# EAGLE schematic Impedance_Potential (EAGLE 9.6.2)
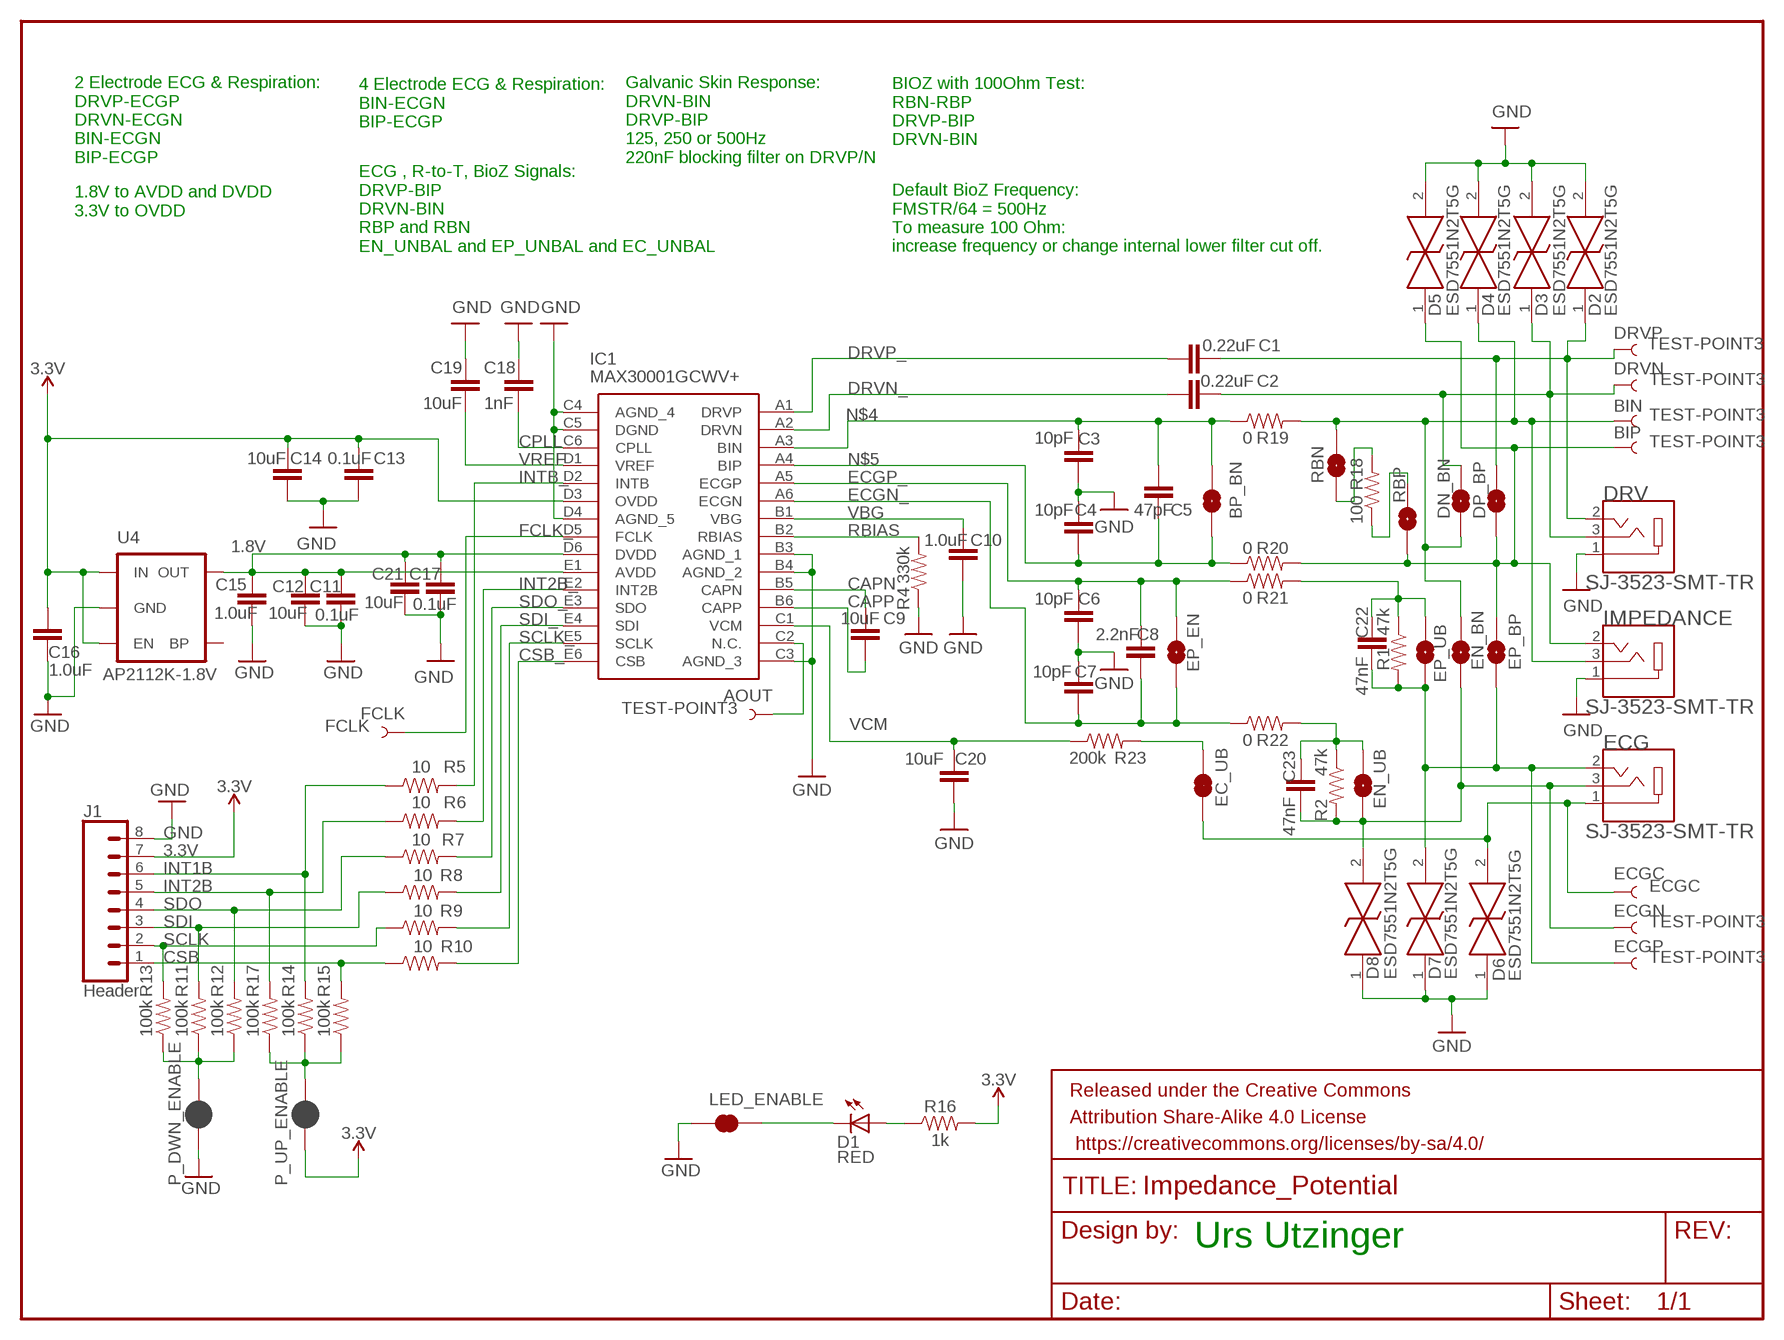
[diagram p0: schematic, sheet 1]

## Parts
AOUT  TEST-POINT3  [PAD.03X.03]
BIN  TEST-POINT3  [PAD.03X.03]
BIP  TEST-POINT3  [PAD.03X.03]
BP_BN  JUMPER-SMT_2_NO_SILK  [SMT-JUMPER_2_NO_SILK]
C1  0.22uF  0.22UF-0603-25V-10%  [0603]
C2  0.22uF  0.22UF-0603-25V-10%  [0603]
C3  10pF  10PF-0603-50V-5%  [0603]
C4  10pF  10PF-0603-50V-5%  [0603]
C5  47pF  47PF-0603-50V-5%  [0603]
C6  10pF  10PF-0603-50V-5%  [0603]
C7  10pF  10PF-0603-50V-5%  [0603]
C8  2.2nF  2.2NF/2200PF-0603-50V-10%  [0603]
C9  10uF  10UF-0603-6.3V-20%  [0603]
C10  1.0uF  1.0UF-0603-16V-10%  [0603]
C11  0.1uF  0.1UF-0603-25V-(+80/-20%)  [0603]
C12  10uF  10UF-0603-6.3V-20%  [0603]
C13  0.1uF  0.1UF-0603-25V-(+80/-20%)  [0603]
C14  10uF  10UF-0603-6.3V-20%  [0603]
C15  1.0uF  1.0UF-0603-16V-10%  [0603]
C16  1.0uF  1.0UF-0603-16V-10%  [0603]
C17  0.1uF  0.1UF-0603-25V-(+80/-20%)  [0603]
C18  1nF  1.0NF/1000PF-0603-50V-10%  [0603]
C19  10uF  10UF-0603-6.3V-20%  [0603]
C20  10uF  10UF-0603-6.3V-20%  [0603]
C21  10uF  10UF-0603-6.3V-20%  [0603]
C22  47nF  47NF-0603-25V-5%  [0603]
C23  47nF  47NF-0603-25V-5%  [0603]
D1  RED  LED-RED0603  [LED-0603]
D2  ESD7551N2T5G  [ESD7551N2T5G]
D3  ESD7551N2T5G  [ESD7551N2T5G]
D4  ESD7551N2T5G  [ESD7551N2T5G]
D5  ESD7551N2T5G  [ESD7551N2T5G]
D6  ESD7551N2T5G  [ESD7551N2T5G]
D7  ESD7551N2T5G  [ESD7551N2T5G]
D8  ESD7551N2T5G  [ESD7551N2T5G]
DN_BN  JUMPER-SMT_2_NO_SILK  [SMT-JUMPER_2_NO_SILK]
DP_BP  JUMPER-SMT_2_NO_SILK  [SMT-JUMPER_2_NO_SILK]
DRV  SJ-3523-SMT-TR  [CUI_SJ-3523-SMT-TR]
DRVN  TEST-POINT3  [PAD.03X.03]
DRVP  TEST-POINT3  [PAD.03X.03]
EC_UB  JUMPER-SMT_2_NC_TRACE_SILK  [SMT-JUMPER_2_NC_TRACE_SILK]
ECG  SJ-3523-SMT-TR  [CUI_SJ-3523-SMT-TR]
ECGC  ECGC  TEST-POINT3  [PAD.03X.03]
ECGN  TEST-POINT3  [PAD.03X.03]
ECGP  TEST-POINT3  [PAD.03X.03]
EN_BN  JUMPER-SMT_2_NO_SILK  [SMT-JUMPER_2_NO_SILK]
EN_UB  JUMPER-SMT_2_NO_SILK  [SMT-JUMPER_2_NO_SILK]
EP_BP  JUMPER-SMT_2_NO_SILK  [SMT-JUMPER_2_NO_SILK]
EP_EN  JUMPER-SMT_2_NO_SILK  [SMT-JUMPER_2_NO_SILK]
EP_UB  JUMPER-SMT_2_NO_SILK  [SMT-JUMPER_2_NO_SILK]
FCLK  FCLK  TEST-POINT3  [PAD.03X.03]
FRAME1  FRAME-LETTERNO_PACKAGE  [DUMMY]
IC1  MAX30001GCWV+  [BGA30C50P6X5_293X274X69]
IMPEDANCE  SJ-3523-SMT-TR  [CUI_SJ-3523-SMT-TR]
J1  Header  CONN_08"  [1X08]
LED_ENABLE  LED ENABLE  JUMPER-SMT_2_NC_TRACE_SILK  [SMT-JUMPER_2_NC_TRACE_SILK]
P_DWN_ENABLE  JUMPER-SMT_2_NC_PASTE_SILK  [SMT-JUMPER_2_NC_PASTE_SILK]
P_UP_ENABLE  JUMPER-SMT_2_NC_PASTE_SILK  [SMT-JUMPER_2_NC_PASTE_SILK]
R1  47k  47KOHM-0603-1/10W-1%  [0603]
R2  47k  47KOHM-0603-1/10W-1%  [0603]
R4  330k  330KOHM-0603-1/10W-1%  [0603]
R5  10  10OHM-0603-1/10W-1%  [0603]
R6  10  10OHM-0603-1/10W-1%  [0603]
R7  10  10OHM-0603-1/10W-1%  [0603]
R8  10  10OHM-0603-1/10W-1%  [0603]
R9  10  10OHM-0603-1/10W-1%  [0603]
R10  10  10OHM-0603-1/10W-1%  [0603]
R11  100k  100KOHM-0603-1/10W-1%  [0603]
R12  100k  100KOHM-0603-1/10W-1%  [0603]
R13  100k  100KOHM-0603-1/10W-1%  [0603]
R14  100k  100KOHM-0603-1/10W-1%  [0603]
R15  100k  100KOHM-0603-1/10W-1%  [0603]
R16  1k  1KOHM-0603-1/10W-1%  [0603]
R17  100k  100KOHM-0603-1/10W-1%  [0603]
R18  100  100OHM-0603-1/10W-1%  [0603]
R19  0  0OHM-0603-1/10W  [0603]
R20  0  0OHM-0603-1/10W  [0603]
R21  0  0OHM-0603-1/10W  [0603]
R22  0  0OHM-0603-1/10W  [0603]
R23  200k  200KOHM-0603-1/10W-1%  [0603]
RBN  JUMPER-SMT_2_NO_SILK  [SMT-JUMPER_2_NO_SILK]
RBP  JUMPER-SMT_2_NO_SILK  [SMT-JUMPER_2_NO_SILK]
U4  AP2112K-1.8V  AP2122K-1.8TRG1SMD  [SPARKFUN-POWERIC_SOT23-5]

## Nets
1.8V: C11.1 C12.1 C15.2 C17.1 C21.1 IC1.D6(DVDD) IC1.E1(AVDD) U4.5(OUT)
3.3V: C13.1 C14.1 C16.2 IC1.D3(OVDD) J1.7 P_UP_ENABLE.1 R16.2 U4.1(IN) U4.3(EN)
AOUT: AOUT.P$1 IC1.C2(N.C.)
BIN: BIN.P$1 D4.1 DN_BN.1 EN_BN.2 IMPEDANCE.3 R19.2 RBN.2
BIP: BIP.P$1 D5.1 DP_BP.1 EP_BP.2 IMPEDANCE.2 R20.2 RBP.1
CAPN: C9.1 IC1.B5(CAPN)
CAPP: C9.2 IC1.B6(CAPP)
CPLL: C18.2 IC1.C6(CPLL)
CSB: J1.1 R10.1 R15.2
CSB_: IC1.E6(CSB) R10.2
DRVN: C2.2 D3.1 DN_BN.2 DRV.3 DRVN.P$1
DRVN_: C2.1 IC1.A2(DRVN)
DRVP: C1.2 D2.1 DP_BP.2 DRV.2 DRVP.P$1
DRVP_: C1.1 IC1.A1(DRVP)
ECGC: D6.2 EC_UB.1 ECG.1 ECGC.P$1
ECGN: C23.2 D8.2 ECG.3 ECGN.P$1 EN_BN.1 EN_UB.1 R2.2
ECGN_: C7.2 C8.2 EP_EN.1 IC1.A6(ECGN) R22.1
ECGP: C22.2 D7.2 ECG.2 ECGP.P$1 EP_BP.1 EP_UB.1 R1.2
ECGP_: C6.1 C8.1 EP_EN.2 IC1.A5(ECGP) R21.1
FCLK_: FCLK.P$1 IC1.D5(FCLK)
GND: C3.2 C4.1 C6.2 C7.1 C10.2 C11.2 C12.2 C13.2 C14.2 C15.1 C16.1 C17.2 C18.1 C19.1 C20.2 C21.2 D2.2 D3.2 D4.2 D5.2 D6.1 D7.1 D8.1 DRV.1 IC1.B3(AGND_1) IC1.B4(AGND_2) IC1.C3(AGND_3) IC1.C4(AGND_4) IC1.C5(DGND) IC1.D4(AGND_5) IMPEDANCE.1 J1.8 LED_ENABLE.1 P_DWN_ENABLE.1 R4.1 U4.2(GND)
INT1B: J1.6 R5.1 R14.2
INT2B: J1.5 R6.1 R17.2
INT2B_: IC1.E2(INT2B) R6.2
INTB_: IC1.D2(INTB) R5.2
N$1: C23.1 EN_UB.2 R2.1 R22.2
N$2: EC_UB.2 R23.2
N$3: C22.1 EP_UB.2 R1.1 R21.2
N$4: BP_BN.2 C3.1 C5.1 IC1.A3(BIN) R19.1
N$5: BP_BN.1 C4.2 C5.2 IC1.A4(BIP) R20.1
N$26: D1.A R16.1
N$28: D1.C LED_ENABLE.2
N$29: P_DWN_ENABLE.2 R11.1 R12.1 R13.1
N$30: P_UP_ENABLE.2 R14.1 R15.1 R17.1
N$32: R18.2 RBN.1
N$33: R18.1 RBP.2
RBIAS: IC1.B2(RBIAS) R4.2
SCLK: J1.2 R9.1 R13.2
SCLK_: IC1.E5(SCLK) R9.2
SDI: J1.3 R8.1 R11.2
SDI_: IC1.E4(SDI) R8.2
SDO: J1.4 R7.1 R12.2
SDO_: IC1.E3(SDO) R7.2
VBG: C10.1 IC1.B1(VBG)
VCM: C20.1 IC1.C1(VCM) R23.1
VREF: C19.2 IC1.D1(VREF)
Unconnected: U4.4(BP)

## Notes on the sheet
- 4 Electrode ECG & Respiration:
  BIN-ECGN
  BIP-ECGP
- BIOZ with 100Ohm Test:
  RBN-RBP
  DRVP-BIP
  DRVN-BIN
- 2 Electrode ECG & Respiration:
  DRVP-ECGP
  DRVN-ECGN
  BIN-ECGN
  BIP-ECGP
- Galvanic Skin Response:
  DRVN-BIN
  DRVP-BIP
  125, 250 or 500Hz
  220nF blocking filter on DRVP/N
- 1.8V to AVDD and DVDD
  3.3V to OVDD
- ECG , R-to-T, BioZ Signals:
  DRVP-BIP
  DRVN-BIN
  RBP and RBN
  EN_UNBAL and EP_UNBAL and EC_UNBAL
- Default BioZ Frequency: 
  FMSTR/64 = 500Hz
  To measure 100 Ohm:
  increase frequency or change internal lower filter cut off.
- Urs Utzinger

## Library data of the parts
AOUT BIN BIP DRVN DRVP ECGC ECGN ECGP FCLK = SparkFun-Connectors:TEST-POINT: SparkFun Test Points Bare copper test points for troubleshooting or In-Circuit-Testing. These are used by our Production team for verifying production board runs using pogo-pins on test beds. SparkFun Products: SparkFun LSM9DS1 Breakout <https://www.sparkfun.com/products/13284> SparkFun PSOC <https://www.sparkfun.com/products/13714> SparkFun Load Cell Amplifier <https://www.sparkfun.com/products/13879>
BP_BN DN_BN DP_BP EN_BN EN_UB EP_BP EP_EN EP_UB RBN RBP = SparkFun-Jumpers:JUMPER-SMT_2_NO: Normally open jumper This jumper has two pads in close proximity to each other. Apply solder to close the connection. Round pads are easier to solder for beginners, but are a lot larger. SparkFun Product that uses the round pads: SparkFun EL Sequencer <https://www.sparkfun.com/products/12781>
C1 C2 = SparkFun-Capacitors:0.22UF: 0.22µF ceramic capacitors A capacitor is a passive two-terminal electrical component used to store electrical energy temporarily in an electric field.; PROD_ID: CAP-07822
C3 C4 C6 C7 = SparkFun-Capacitors:10PF: 10pF ceramic capacitors A capacitor is a passive two-terminal electrical component used to store electrical energy temporarily in an electric field.; PROD_ID: CAP-11812
C5 = SparkFun-Capacitors:47PF: 47pF ceramic capacitors A capacitor is a passive two-terminal electrical component used to store electrical energy temporarily in an electric field.; PROD_ID: CAP-08913
C8 = SparkFun-Capacitors:2.2NF/2200PF: 2.2nF/2,200pF ceramic capacitors A capacitor is a passive two-terminal electrical component used to store electrical energy temporarily in an electric field.; PROD_ID: CAP-07877
C9 C12 C14 C19-C21 = SparkFun-Capacitors:10UF: 10.0µF ceramic capacitors A capacitor is a passive two-terminal electrical component used to store electrical energy temporarily in an electric field.; PROD_ID: CAP-11015
C10 C15 C16 = SparkFun-Capacitors:1.0UF: 1µF ceramic capacitors A capacitor is a passive two-terminal electrical component used to store electrical energy temporarily in an electric field.; PROD_ID: CAP-00868
C11 C13 C17 = SparkFun-Capacitors:0.1UF: 0.1µF ceramic capacitors A capacitor is a passive two-terminal electrical component used to store electrical energy temporarily in an electric field.; PROD_ID: CAP-00810
C18 = SparkFun-Capacitors:1.0NF/1000PF: 1nF/1,000pF ceramic capacitors A capacitor is a passive two-terminal electrical component used to store electrical energy temporarily in an electric field.; PROD_ID: CAP-07886
C22 C23 = SparkFun-Capacitors:47NF: 47nF ceramic capacitors A capacitor is a passive two-terminal electrical component used to store electrical energy temporarily in an electric field.; PROD_ID: CAP-08605
D1 = SparkFun-LED:LED-RED: Assorted Red LEDs LilyPad 1206- DIO-09912 1206- DIO-00809 0603- DIO-00819; PROD_ID: DIO-00819
D2-D8 = ESD7551N2T5G:ESD7551N2T5G: ESD Suppressors / TVS Diodes BI-DIRECTIONAL 5V ESD PR Source: Datasheet <http://www.onsemi.com/pub/Collateral/ESD7551-D.PDF>; DESCRIPTION: ESD Suppressors / TVS Diodes BI-DIRECTIONAL 5V ESD PR; HEIGHT: 0.4mm; MANUFACTURER_NAME: onsemi; MANUFACTURER_PART_NUMBER: ESD7551N2T5G; MOUSER_PART_NUMBER: 863-ESD7551N2T5G; MOUSER_PRICE-STOCK: https://www.mouser.co.uk/ProductDetail/onsemi/ESD7551N2T5G?qs=5aG0NVq1C4x8NutXGbtG6w%3D%3D
DRV ECG IMPEDANCE = SJ-3523-SMT-TR:SJ-3523-SMT-TR: Audio Jack Connector 3.5 mm Low Profile Surface Mount Stereo Jack, 3 Pin Right-Angle Check availability <https://pricing.snapeda.com/parts/SJ-3523-SMT-TR/CUI%20Devices/view-part?ref=eda>; AVAILABILITY: In Stock; CUI_PURCHASE_URL: https://www.cuidevices.com/product/interconnect/connectors/audio-connectors/jacks/sj-352x-smt-series?utm_source=snapeda.com&utm_medium=referral&utm_campaign=snapedaBOM; DESCRIPTION: 3.5 mm, Stereo, Right Angle, Surface Mount (SMT), 3 Conductors, 0~1 Internal Switches, Audio Jack Connector; MF: CUI Devices; MP: SJ-3523-SMT-TR; PACKAGE: None; PRICE: None; PURCHASE-URL: https://pricing.snapeda.com/search/part/SJ-3523-SMT-TR/?ref=eda
EC_UB LED_ENABLE = SparkFun-Jumpers:JUMPER-SMT_2_NC_TRACE: Normally closed trace jumper This jumper has a trace between two pads so it's normally closed (NC). Use a razor knife to open the connection. For best results follow the IPC guidelines for cutting traces: Cutout at least 0.063 mm (0.005 in). Remove all loose material to clean up the cut area. Seal the cut with an approved epoxy. Reapply solder to reclose the connection.
FRAME1 = SparkFun-Aesthetics:FRAME-LETTER: Schematic Frame - Letter Standard 8.5x11 US Letter frame; DESIGNER: Nobody; VERSION: v01
IC1 = MAX30001GCWV+:MAX30001GCWV+: MAXIM INTEGRATED / ANALOG DEVICES - MAX30001GCWV+ - 1 LEAD ECG & BIOZ AFE Source: Datasheet <https://datasheets.maximintegrated.com/en/ds/MAX30001G.pdf>; DESCRIPTION: MAXIM INTEGRATED / ANALOG DEVICES - MAX30001GCWV+ - 1 LEAD ECG & BIOZ AFE; HEIGHT: 0.69mm; MANUFACTURER_NAME: Analog Devices; MANUFACTURER_PART_NUMBER: MAX30001GCWV+; MOUSER_PART_NUMBER: 700-MAX30001GCWV+; MOUSER_PRICE-STOCK: https://www.mouser.co.uk/ProductDetail/Analog-Devices-Maxim-Integrated/MAX30001GCWV%2b?qs=Rp5uXu7WBW%2FLfomdQH9F5g%3D%3D
J1 = SparkFun-Connectors:CONN_08: Multi connection point. Often used as Generic Header-pin footprint for 0.1 inch spaced/style header connections On any of the 0.1 inch spaced packages, you can populate with these: Break Away Headers - Straight <https://www.sparkfun.com/products/116> (PRT-00116) Break Away Male Headers - Right Angle <https://www.sparkfun.com/products/553> (PRT-00553) Female Headers <https://www.sparkfun.com/products/115> (PRT-00115) Break Away Headers - Machine Pin <https://www.sparkfun.com/products/117> (PRT-00117) Break Away Female Headers - Swiss Machine Pin <https://www.sparkfun.com/products/743> (PRT-00743) Arduino Stackable Header - 8 Pin <https://www.sparkfun.com/products/9279> (PRT-09279) For SCREWTERMINALS and SPRING TERMINALS visit here: Screw Terimnals on SparkFun.com <https://www.sparkfun.com/search/results?term=Screw+Terminals> (5mm/3.5mm/2.54mm spacing) This device is also useful as a general connection point to wire up your design to another part of your project. Our various solder wires solder well into these plated through hole pads. Hook-Up Wire - Assortment (Stranded, 22 AWG) <https://www.sparkfun.com/products/11375> (PRT-11375) Hook-Up Wire - Assortment (Solid Core, 22 AWG) <https://www.sparkfun.com/products/11367> (PRT-11367) View the entire wire category on our website here <https://www.sparkfun.com/categories/141> Special notes: Molex polarized connector foot print use with SKU : PRT-08231 with associated crimp pins and housings. 1MM SMD Version SKU: PRT-10208 NOTES ON THE VARIANTS LOCK and LOCK_LONGPADS... This footprint was designed to help hold the alignment of a through-hole component (i.e. 6-pin header) while soldering it into place. You may notice that each hole has been shifted either up or down by 0.005 of an inch from it's more standard position (which is a perfectly straight line). This slight alteration caused the pins (the squares in the middle) to touch the edges of the holes. Because they are alternating, it causes a "brace" to hold the component in place. 0.005 has proven to be the perfect amount of "off-center" position when using our standard breakaway headers. Although looks a little odd when you look at the bare footprint, once you have a header in there, the alteration is very hard to notice. Also,if you push a header all the way into place, it is covered up entirely on the bottom side.; PROD_ID: CONN-08438
P_DWN_ENABLE P_UP_ENABLE = SparkFun-Jumpers:JUMPER-SMT_2_NC_PASTE: Normally closed solder jumper This jumper has an aperture in the stencil to allow solder paste to bridge the split in the wire so it's normally closed (NC). Wick off the solder to open the connection. Reapply solder to reclose the connection.
R1 R2 = SparkFun-Resistors:47KOHM: 47kΩ resistor A resistor is a passive two-terminal electrical component that implements electrical resistance as a circuit element. Resistors act to reduce current flow, and, at the same time, act to lower voltage levels within circuits. - Wikipedia; PROD_ID: RES-07871
R4 = SparkFun-Resistors:330KOHM: 330kΩ resistor A resistor is a passive two-terminal electrical component that implements electrical resistance as a circuit element. Resistors act to reduce current flow, and, at the same time, act to lower voltage levels within circuits. - Wikipedia; PROD_ID: RES-08968
R5-R10 = SparkFun-Resistors:10OHM: 10Ω resistor A resistor is a passive two-terminal electrical component that implements electrical resistance as a circuit element. Resistors act to reduce current flow, and, at the same time, act to lower voltage levels within circuits. - Wikipedia; PROD_ID: RES-12581
R11-R15 R17 = SparkFun-Resistors:100KOHM: 100kΩ resistor A resistor is a passive two-terminal electrical component that implements electrical resistance as a circuit element. Resistors act to reduce current flow, and, at the same time, act to lower voltage levels within circuits. - Wikipedia; PROD_ID: RES-07828
R16 = SparkFun-Resistors:1KOHM: 1kΩ resistor A resistor is a passive two-terminal electrical component that implements electrical resistance as a circuit element. Resistors act to reduce current flow, and, at the same time, act to lower voltage levels within circuits. - Wikipedia; PROD_ID: RES-07856
R18 = SparkFun-Resistors:100OHM: 100Ω resistor A resistor is a passive two-terminal electrical component that implements electrical resistance as a circuit element. Resistors act to reduce current flow, and, at the same time, act to lower voltage levels within circuits. - Wikipedia; PROD_ID: RES-07863
R19-R22 = SparkFun-Resistors:0OHM: 0Ω resistor A resistor is a passive two-terminal electrical component that implements electrical resistance as a circuit element. Resistors act to reduce current flow, and, at the same time, act to lower voltage levels within circuits. - Wikipedia; PROD_ID: RES-08609
R23 = SparkFun-Resistors:200KOHM: 200kΩ resistor A resistor is a passive two-terminal electrical component that implements electrical resistance as a circuit element. Resistors act to reduce current flow, and, at the same time, act to lower voltage levels within circuits. - Wikipedia; PROD_ID: RES-09385
U4 = AP2112K-1.8TRG1:AP2122K-1.8TRG1: Voltage Regulator LDO Standard 150mA LDO voltage regulator in SOT-23 layout. Micrel part MIC5205. BP (by-pass) pin is used to lower output noise with 470pF cap.; PROD_ID: VREG-12457